# Altium schematic sheet Poseidon_SystemModule.SchDoc: Poseidon (System Module)
size Letter; Address1: Glenn Lopez; Address2: glennlopez@gmail.com; Revision: A1; SheetNumber: 1; SheetTotal: 1
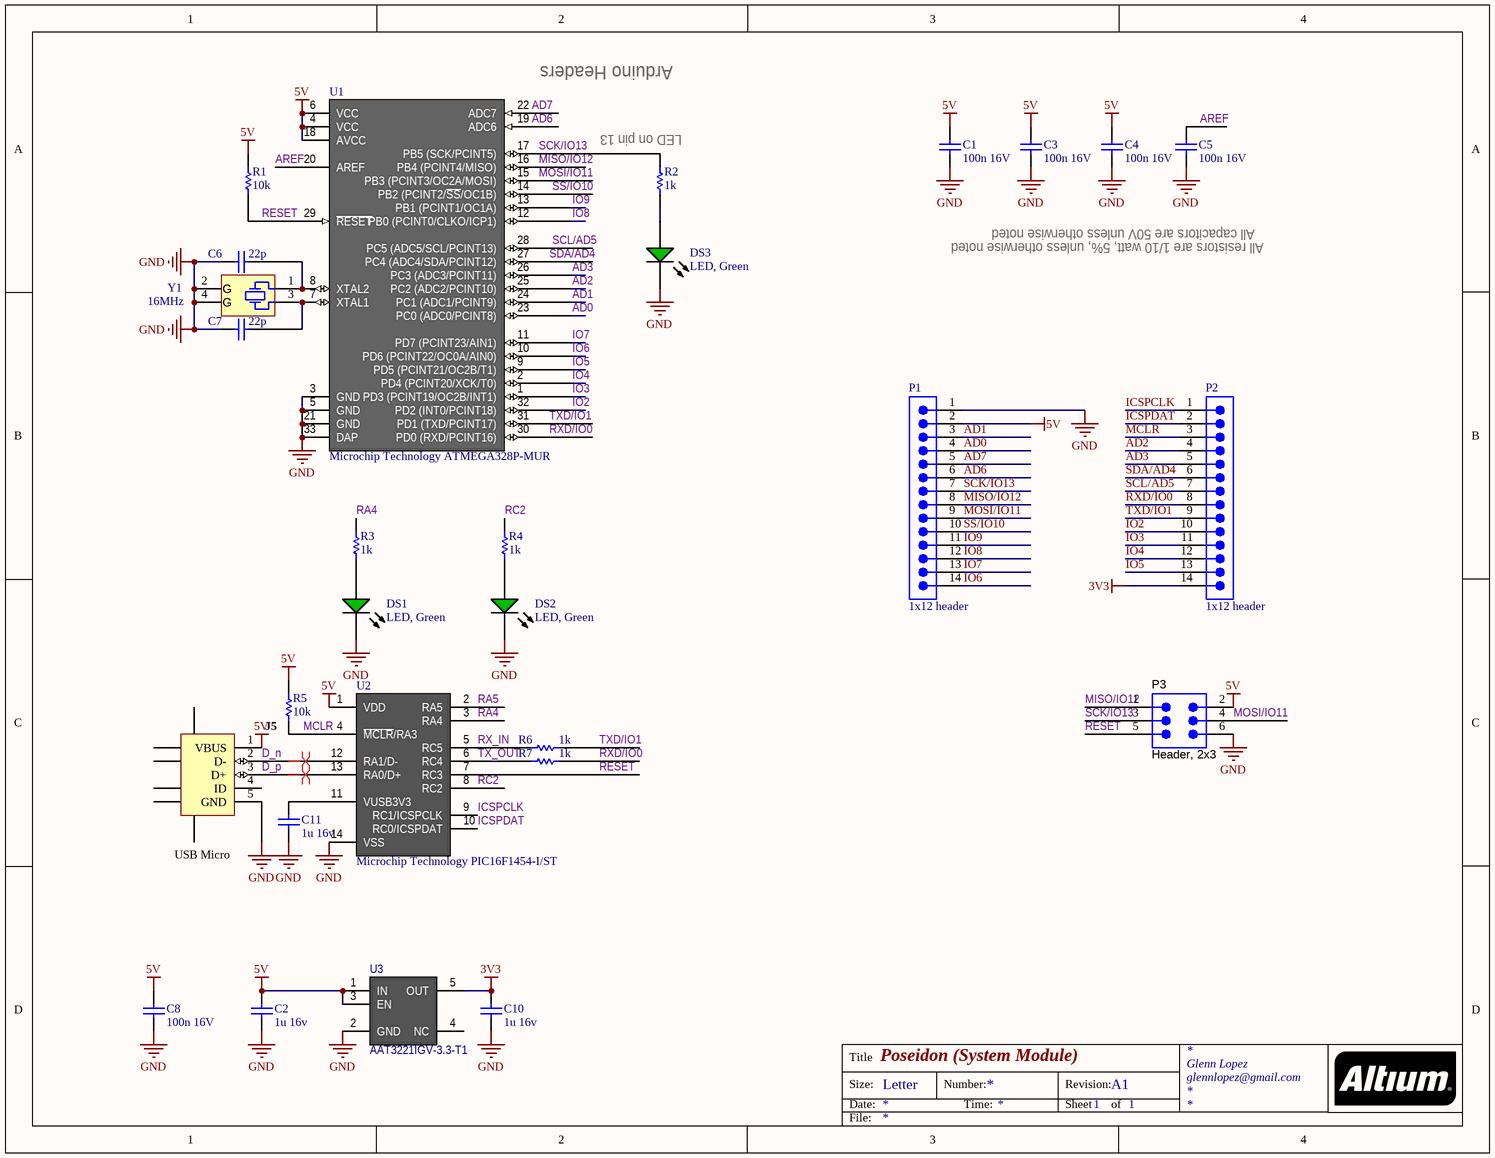
[diagram p0: Poseidon_SystemModule.SchDoc]

## Parts
C1  100n 16V  [CAPC1005X55X30NL05T10]
C2  1u 16v  [CAPC1608X90X35ML15T15]
C3  100n 16V  [CAPC1005X55X30NL05T10]
C4  100n 16V  [CAPC1005X55X30NL05T10]
C5  100n 16V  [CAPC1005X55X30NL05T10]
C6  22p  [CAPC1005X55X25LL05T05]
C7  22p  [CAPC1005X55X25LL05T05]
C8  100n 16V  [CAPC1005X55X30NL05T10]
C10  1u 16v  [CAPC1608X90X35ML15T15]
C11  1u 16v  [CAPC1608X90X35ML15T15]
DS1  LED, Green  [LTON_LTST-C190GKT]
DS2  LED, Green  [LTON_LTST-C190GKT]
DS3  LED, Green  [LTON_LTST-C190GKT]
J5  USB Micro  [HIRO-ZX62R-B-5P_V]
P1  1x12 header  [PCB-3412241-1]
P2  1x12 header  [PCB-3412241-1]
P3  Header, 2x3  [2X03]
R1  10k  [RESC1005X40X25NL05T10]
R2  1k  [RESC1005X40X25ML10T10]
R3  1k  [RESC1005X40X25ML10T10]
R4  1k  [RESC1005X40X25ML10T10]
R5  10k  [RESC1005X40X25NL05T10]
R6  1k  [RESC1005X40X25ML10T10]
R7  1k  [RESC1005X40X25ML10T10]
U1  Microchip Technology ATMEGA328P-MUR  [PCB-1210586-1]
U2  Microchip Technology PIC16F1454-I/ST  [PCB-4286474-1]
U3  AAT3221IGV-3.3-T1  [PCB-8081266-1]
Y1  16MHz  [ABCN-ABM3B]

## Nets
3V3: C10.2 P2.14 U3.5(OUT)
5V: C1.2 C2.2 C3.2 C4.2 C8.2 J5.1(VBUS) P1.2 P3.2 R1.2 R5.2 U1.4(VCC) U1.6(VCC) U1.18(AVCC) U2.1(VDD) U3.1(IN) U3.3(EN)
GND: C1.1 C2.1 C3.1 C4.1 C5.1 C6.1 C7.1 C8.1 C10.1 C11.1 DS1.2(K) DS2.2(K) DS3.2(K) J5.5(GND) P1.1 P3.6 U1.3(GND) U1.5(GND) U1.21(GND) U1.33(DAP) U2.14(VSS) U3.2(GND) Y1.2(GND) Y1.4(GND)
AD0: P1.4 U1.23(PC0_(ADC0/PCINT8))
AD1: P1.3 U1.24(PC1_(ADC1/PCINT9))
AD2: P2.4 U1.25(PC2_(ADC2/PCINT10))
AD3: P2.5 U1.26(PC3_(ADC3/PCINT11))
AD6: P1.6 U1.19(ADC6)
AD7: P1.5 U1.22(ADC7)
AREF: C5.2 U1.20(AREF)
D_n: J5.2(D-) U2.12(RA1/D-)
D_p: J5.3(D+) U2.13(RA0/D+)
ICSPCLK: P2.1 U2.9(RC1/ICSPCLK)
ICSPDAT: P2.2 U2.10(RC0/ICSPDAT)
IO2: P2.10 U1.32(PD2_(INT0/PCINT18))
IO3: P2.11 U1.1(PD3_(PCINT19/OC2B/INT1))
IO4: P2.12 U1.2(PD4_(PCINT20/XCK/T0))
IO5: P2.13 U1.9(PD5_(PCINT21/OC2B/T1))
IO6: P1.14 U1.10(PD6_(PCINT22/OC0A/AIN0))
IO7: P1.13 U1.11(PD7_(PCINT23/AIN1))
IO8: P1.12 U1.12(PB0_(PCINT0/CLKO/ICP1))
IO9: P1.11 U1.13(PB1_(PCINT1/OC1A))
MCLR: P2.3 R5.1 U2.4(~{MCLR}/RA3)
MISO/IO12: P1.8 P3.1 U1.16(PB4_(PCINT4/MISO))
MOSI/IO11: P1.9 P3.4 U1.15(PB3_(PCINT3/OC2A/MOSI))
RA4: R3.2 U2.3(RA4)
RA5: U2.2(RA5)
RC2: R4.2 U2.8(RC2)
RESET: P3.5 R1.1 U1.29(~{RESET}) U2.7(RC3)
RX_IN: R6.2 U2.5(RC5)
RXD/IO0: P2.8 R7.1 U1.30(PD0_(RXD/PCINT16))
SCK/IO13: P1.7 P3.3 R2.2 U1.17(PB5_(SCK/PCINT5))
SCL/AD5: P2.7 U1.28(PC5_(ADC5/SCL/PCINT13))
SDA/AD4: P2.6 U1.27(PC4_(ADC4/SDA/PCINT12))
SS/IO10: P1.10 U1.14(PB2_(PCINT2/~{SS}/OC1B))
TX_OUT: R7.2 U2.6(RC4)
TXD/IO1: P2.9 R6.1 U1.31(PD1_(TXD/PCINT17))
NetC6_2: C6.2 U1.8(XTAL2) Y1.1
NetC7_2: C7.2 U1.7(XTAL1) Y1.3
NetC11_2: C11.2 U2.11(VUSB3V3)
NetDS1_1: DS1.1(A) R3.1
NetDS2_1: DS2.1(A) R4.1
NetDS3_1: DS3.1(A) R2.1

Not connected (* = marked no-connect by the designer): J5 4(ID) 6(SHLD) 7(SHLD) 8(SHLD) 9(SHLD) 10(SHLD) 11(SHLD); U3 4(NC)

## Layout directives
differential pair: D_n, D_p

## Notes on the sheet
- (near U1) Arduino Headers
- (near R2) LED on pin 13
- All capacitors are 50V unless otherwise noted
- All resistors are 1/10 watt, 5%, unless otherwise noted
- Title
- Size:
- Date:
- Letter
- Number:
- Time:
- Revision:
- Sheet
- of
- File:
- (in symbol CMP-780013-1) G

## Library data of the parts
C1 C3-C5 C8 = CMP-154672-1: Multilayer Ceramic Capacitors MLCC - SMD/SMT 16volts 0.1uF X7R 5%; Manufacturer Part Number: C0402C104J4RACTU; Part # Aliases: C0402C104J4RAC7867; Manufacturer: Kemet; Class: Class 1; Case Length: 1 mm; Capacitance - nF: 100 nF; Capacitance - pF: 100000 pF; Temperature Coefficient / Code: +/- 15 %; Case Height: 0.5 mm; CiivaID: 154672; Dissipation Factor DF: 3.5; Type: SMD MLCC X7R 6.3 - 250 VDC Commerical Grade; Case Code - mm: 1005; Tolerance: 5 %; Termination Style: SMD/SMT; Dimensions: 0.5 mm W x 1 mm L x 0.5 mm H; Voltage Rating DC: 16 V; Packaging: Reel; Dielectric: X7R; Case Width: 0.5 mm; Case Code - in: 0402; RoHS: Details; Product: General Type MLCCs; Voltage Rating: 16 V; Operating Temperature Range: - 55 C to + 125 C; Package / Case: 0402 (1005 metric); Factory Pack Quantity: 10000; Brand: Kemet; Minimum Operating Temperature: - 55 C; Capacitance: 0.1 uF; Maximum Operating Temperature: + 125 C; Series: C0402C; Ciiva URL: https://ciiva.com/part/c0402c104j4ractu-154672; Product Category: Multilayer Ceramic Capacitors MLCC - SMD/SMT
C2 C10 C11 = CMP-126011-1: CAP CER 1UF 16V 10% X5R 0603; Manufacturer Part Number: 0603YD105KAT2A; CiivaID: 126011; Capacitance: 1 µF; Rated Voltage: 16 V; Ciiva URL: https://ciiva.com/part/0603yd105kat2a-126011; Case Size/Dimension: 0603; Tolerance (%): ±10 %; Dielectric: X5R
C6 C7 = CMP-123580-2: CAP CER 22PF 50V 5% NPO 0402; Manufacturer Part Number: CC0402JRNPO9BN220; Dynamic Catalog: CC Series; Product Training Modules: Multilayer Ceramic Capacitors; Other Names: 311-1018-6; Catalog Drawings: CC_0402; Temperature Coefficient: C0G, NP0; Featured Product: Commodity Multilayer Ceramic Capacitors – CC Series; CiivaID: 123580; Tolerance: ±5%; Ciiva URL: https://ciiva.com/part/cc0402jrnpo9bn220-123580; Category: Capacitors; Family: Ceramic Capacitors; Packaging: Digi-Reel®; Applications: General Purpose; Package / Case: 0402 (1005 Metric); Standard Package: 1; Voltage - Rated: 50V; Mounting Type: Surface Mount, MLCC; Capacitance: 22pF; Series: CC; Size / Dimension: 0.039" L x 0.020" W (1.00mm x 0.50mm); Operating Temperature: -55°C ~ 125°C; Thickness (Max): 0.022" (0.55mm)
DS1-DS3 = CMP-1544853-1: LED GREEN CLEAR 0603 SMD; Manufacturer Part Number: LTST-C190GKT; High Brightness: No; Shape Type: Rectangular; Product Depth (mm): 0.8 mm; Dominant Wave Length: 569 nm; Test Current (It): 10 mA; Forward Current: 30 mA; Number of  Elements: 1; Chip Material: GaP; Power Dissipation: 100 W; Forward Voltage: 2.6 V; Emitting Color: Yellow Green; Peak Wavelength: 565 nm; Product Length (mm): 1.6 mm; Reverse Voltage: 5 V; Type: Uni-Color; Viewing Angle: 130 deg; DELETED: Compliant; Main Category: Chip LED; Lum Intensity: 6mcd; CiivaID: 1544853; Lens Dimensions: 1.06X0.8X0.52 mm; Operating Temp Range: -55C to 85C; Product Height (mm): 0.8 mm; Operating Temperature Classification: Industrial; Package Type: SMD; Mounting: Surface Mount; Ciiva URL: https://ciiva.com/part/LTST-C190GKT-1544853; Packaging: Tape and Reel; Rad Hardened: No; Pin Count: 2; Luminous Intensity: 6mcd
J5 = CMP-777732-1: Connector; USBMicro-B,Reverse type, SMT; 5 Position; Right Angle; Manufacturer: Hirose Electric (HRS); Rated current: 1/ContactA; Number of poles: 5; Shape/Type: Right Angle/SMT; Pitch: 0.65mm; CiivaID: 777732; Ciiva URL: https://ciiva.com/part/zx62r-b-5p-777732; Feature: Micro-USBï¼ˆUSB2.0ï¼‰connector; Product type: receptacle; Standard: 2USB2.0
P1 P2 = CMP-3412241-A.4: Headers & Wire Housings 2.54MM BREAKAWAY Vertical 14 CKT Tin; Part # Aliases: 0022284140 42375-0014; Voltage Rating: 250 V; Number of Positions: 14; Current Rating: 4 A; Brand: Molex; Manufacturer Part Number: 22-28-4140; Type: Breakaway; Product Category: Headers & Wire Housings; Contact Material: Brass; Housing Material: Thermoplastic; Tradename: KK; Packaging: Bulk; Mounting Style: Through Hole; RoHS: Details; Mounting Angle: Vertical; Product Type: Headers; Series: 42375; Factory Pack Quantity: 750; Ciiva URL: https://ciiva.com/part/22-28-4140-3412241; Contact Plating: Tin; Number of Rows: 1; Termination Style: Through Hole; Manufacturer: Molex; Pitch: 2.54 mm; CiivaID: 3412241; Number of Positions / Contacts: 14
P3 = CMP-664156-2: TE Connectivity AMPMODU Series, 2.54mm Pitch 6 Way 2 Row Straight PCB Header, Solder Termination, 3A; Manufacturer Part Number: 826656-3; 3D Model: 826656-3.pdf; Number of Positions Loaded: All; CiivaID: 664156; Number of Positions: 6; Row Spacing: 0.100" (2.54mm); Connector Type: Header, Unshrouded, Breakaway; Series: AMPMODU Mod II; Color: Green; Termination: Solder; Packaging: Bulk; Contact Mating Length: 0.228" (5.80mm); Contact Finish: Gold; Contact Finish Thickness: 31.5µin (0.80µm); Family: Rectangular Connectors - Headers, Male Pins; Category: Connectors, Interconnects; Contact Type: Male Pin; Number of Rows: 2; Ciiva URL: https://ciiva.com/part/826656-3-664156; Pitch: 0.100" (2.54mm); Mounting Type: Through Hole; RoHS Information: 826656-3 Statement of Compliance; Standard Package: 3,024
R1 R5 = CMP-1853089-1: YAGEO (PHYCOMP)   RC0402FR-0710KL   RESISTOR, 10K, 1%, 0.063W, 0402; Temperature Coefficient: 100 PPM / C; Resistance: 10 kOhms; Power Rating: 62.5 mW (1/16 W); Voltage Rating: 50 V; Case Code - in: 0402; Series: RC; Operating Temperature Range: - 55 C to + 155 C; Tolerance: 1 %; Manufacturer Part Number: RC0402FR-0710KL; CiivaID: 1853089; Termination Style: SMD/SMT; Ciiva URL: https://ciiva.com/part/RC0402FR-0710KL-1853089; Case Code - mm: 1005; Product: Thick Film Resistors General Purpose; Packaging: Reel
R2-R4 R6 R7 = CMP-3934971-1: MULTICOMP   MC 0.0625W 0402 1% 215K   RESISTOR, 0402, 1%, 215K; Manufacturer Part Number: MC00625W04021215K; Power Rating: 62.5mW; Voltage Rating: 50V; Resistance: 215kohm; SVHC: –; Temperature Coefficient: ± 100ppm/°C; Resistor Mounting: SMD; Resistor Element Material: Thick Film; Resistor Case Style: 0402 [1005 Metric]; Resistance Tolerance: ± 1%; Ciiva URL: https://ciiva.com/part/MC0.0625W04021%215K-3934971; MSL: MSL 1 - Unlimited; Resistor Terminals: –; CiivaID: 3934971
U1 = CMP-1210586-4: MCU AVR 32K FLASH 20MHZ 32QFN; Peripherals: Brown-out Detect/Reset, POR, PWM, WDT; EEPROM Size: 128 x 8; Program Memory Size: 3.5KB (2K x 14); Connectivity: I²C, SPI, UART/USART; Voltage - Supply (Vcc/Vdd): 2 V ~ 5.5 V; Data Converters: A/D 11x10b; Number of I /O: 24; Core Processor: PIC; Core Size: 8-Bit; Oscillator Type: Internal; Manufacturer: Microchip Technology; Packaging: Tube; Manufacturer Part Number: ATMEGA328P-MUR; Speed: 20MHz; RAM Size: 128 x 8; CiivaID: 1210586; Series: PIC® 16F; Package / Case: 28-VQFN Exposed Pad; Operating Temperature: -40°C ~ 125°C; Ciiva URL: https://ciiva.com/part/atmega328p-mur-1210586; Program Memory Type: FLASH
U2 = CMP-4286474-1: Microcontroller 8 Bit TSSOP-14, PIC16F1454-I/ST; Program Memory Size: 14KB; Controller Family/Series: PIC16F; Peripherals: PWM, Timer; Supply Voltage Min: 2.3V; SVHC: No SVHC (19-Dec-2012); No. of I/O's: 11; RAM Memory Size: 1KB; Core Size: 8bit; Supply Voltage Max: 5.5V; Embedded Interface Type: EUSART, I2C, SPI, USB; CPU Speed: 48MHz; Digital IC Case Style: TSSOP; No. of Pins: 14; MSL: MSL 1 - Unlimited; Operating Temperature Min: -40°C; Manufacturer Part Number: PIC16F1454-I/ST; Ciiva URL: https://ciiva.com/part/pic16f1454-i-st-4286474; Operating Temperature Max: 85°C; CiivaID: 4286474
U3 = CMP-8081266-1: Low Dropout Regulators - LDO 150mA NanoPower LDO Linear Regulator; PCN Obsolescence/ EOL: Multiple Devices 12/Jan/2015; Unit PriceUSD: NanoPower™; Other Names: 863-1491-2AAT3221IGV-3.3-T1-NDQ7010212; Number of Regulators: 1; Regulator Topology: Positive Fixed; Voltage - Output: 3.3V; Voltage - Input: Up to 5.5V; Voltage - Dropout (Typical): 0.18V @ 100mA; Online Catalog: 3.1V to 3.3V; CiivaID: 8081266; Packaging: Tape & Reel (TR); Current - Output: 150mA; Package/Case: SC-74A, SOT-753; Operating Temperature: -40°C ~ 85°C; Minimum Quantity: 1; Supplier Device Package: SOT-23-5; Package / Case: SC-74A, SOT-753; Ciiva URL: https://ciiva.com/part/aat3221igv-3-3-t1-8081266; Category: Integrated Circuits (ICs); Quantity Available: BulkAlternate Packaging; Standard Package: 3,000; Series: NanoPower™; Family: PMIC - Voltage Regulators - Linear (LDO); Mounting Type: Surface Mount; Manufacturer Part Number: AAT3221IGV-3.3-T1; Dynamic Catalog: 3.1V to 3.3V
Y1 = CMP-780013-1: CRYSTAL 16.000MHZ 18PF SMD; Manufacturer Part Number: ABM3B-16.000MHZ-B2-T; Operating Mode: Fundamental; CiivaID: 780013; Catalog Drawings: ABM3B Series TopABM3B Series SideABM3B Series FootprintABM3B Series Circuit; Frequency Tolerance: ±20ppm; Associated Product: 535-10138-ND- SOCKET 4PAD 5.0X3.2 XTAL OR OSC535-10137-ND- SOCKET 4PAD 5.0X3.2 XTAL OR OSC535-10136-ND- SOCKET 4PAD 5.0X3.2 XTAL OR OSC535-10135-ND- SOCKET 4PAD 5.0X3.2 XTAL OR OSC535-10134-ND- SOCKET 4PAD 5.0X3.2 XTAL OR OSC; ESR (Equivalent Series Resistance): 50 Ohm; Dynamic Catalog: ABM3B Series; Frequency Stability: ±50ppm; Other Names: 535-9122-6; Packaging: Digi-Reel®; Size / Dimension: 0.197" L x 0.126" W (5.00mm x 3.20mm); Operating Temperature: -20°C ~ 70°C; Ciiva URL: https://ciiva.com/part/ABM3B-16.000MHZ-B2-T-780013; Standard Package: 1; Height: 0.043" (1.10mm); Frequency: 16MHz; Series: ABM3B; Category: Crystals and Oscillators; Mounting Type: Surface Mount; Type: MHz Crystal; Load Capacitance: 18pF; Family: Crystals; Package / Case: 4-SMD, No Lead (DFN, LCC)